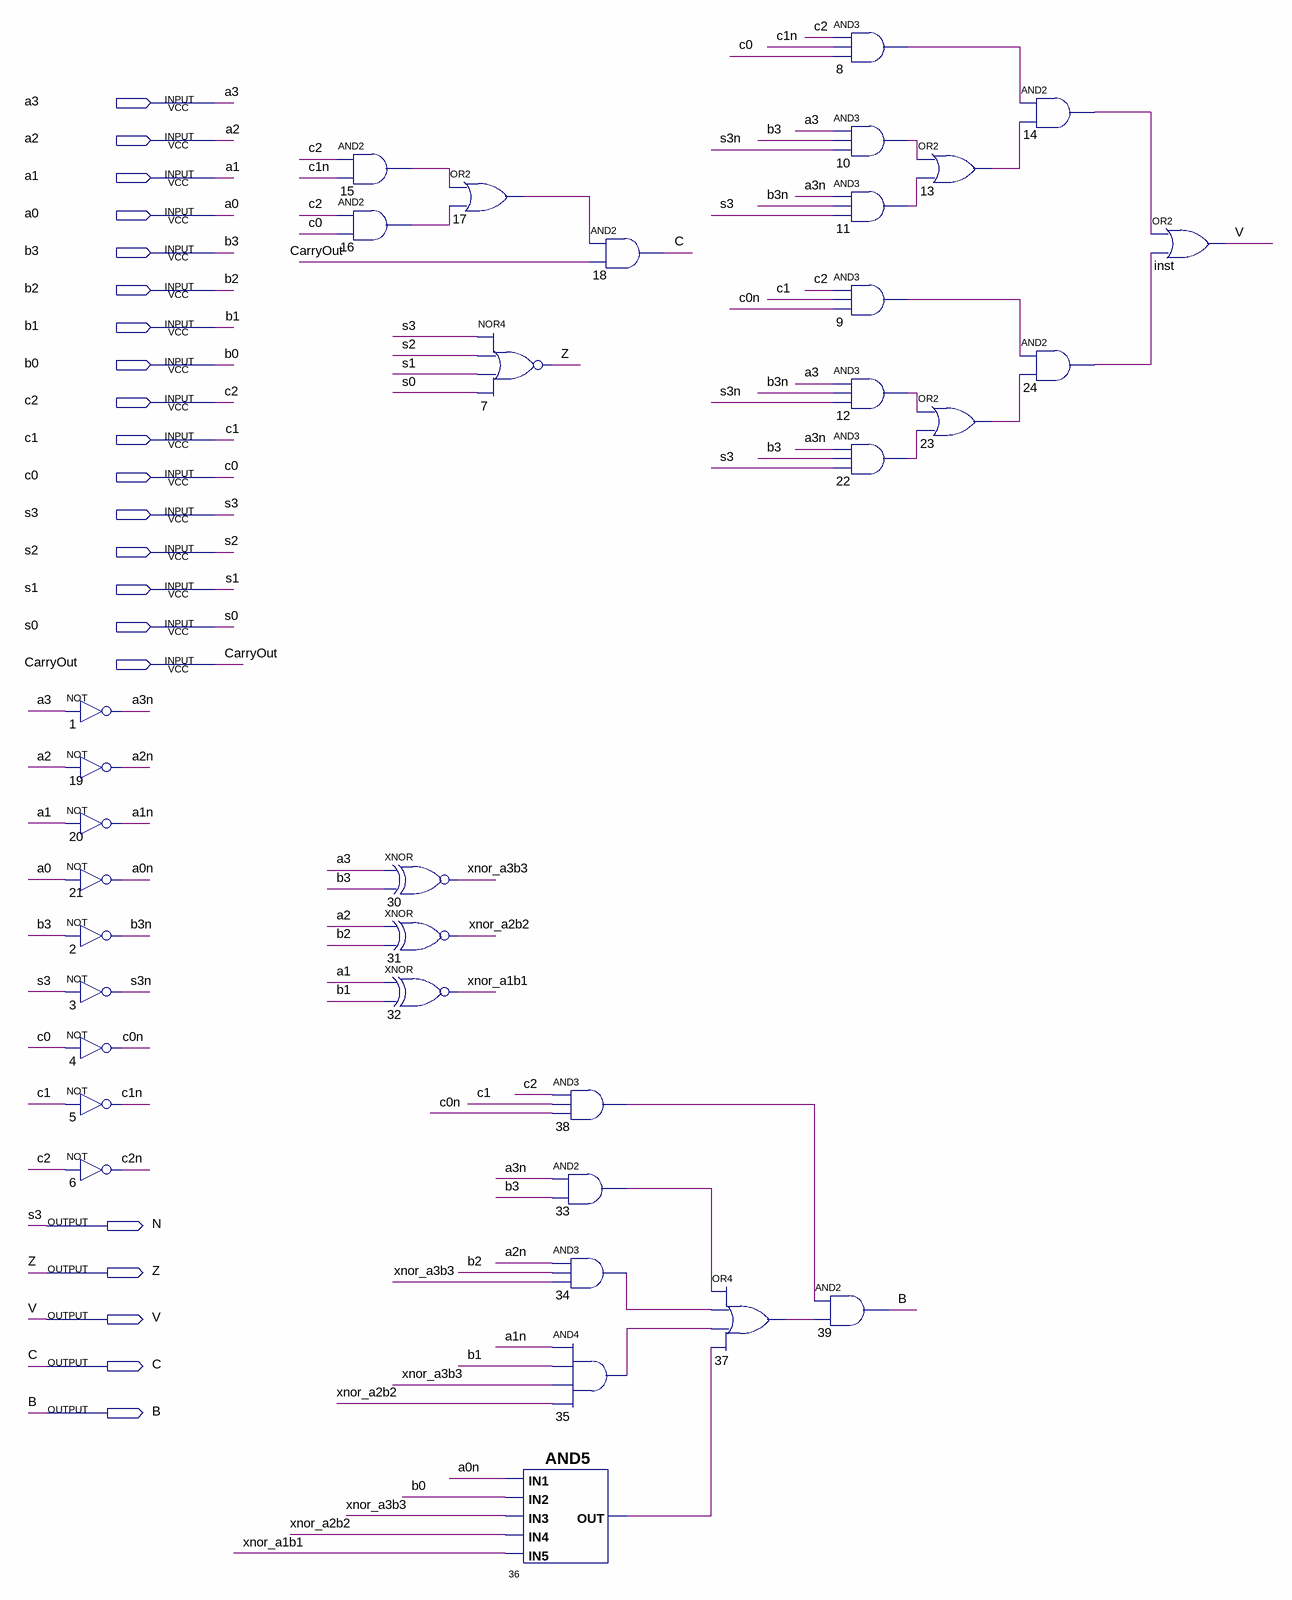
[diagram p0: schematic sheet]
// Quartus schematic flagsNZVCB.bdf as structural Verilog: 35 symbols, 21 pins
module flagsNZVCB (
  input  a3,
  input  a2,
  input  a1,
  input  a0,
  input  b3,
  input  b2,
  input  b1,
  input  b0,
  input  c2,
  input  c1,
  input  c0,
  input  s3,
  input  s2,
  input  s1,
  input  s0,
  input  CarryOut,
  output N,
  output Z,
  output V,
  output C,
  output B
);

  wire a0n, a1n, a2n, a3n, b3n, c0n, c1n, c2n, n8_out, n9_out, n10_out, n11_out, n12_out, n13_out, n14_out,
       n15_out, n16_out, n17_out, n22_out, n23_out, n24_out, n33_out, n34_out, n35_out, n36_out, n37_out,
       n38_out, s3n, xnor_a1b1, xnor_a2b2, xnor_a3b3;

  not u_1 (a3n, a3);
  not u_19 (a2n, a2);
  not u_20 (a1n, a1);
  not u_21 (a0n, a0);
  not u_2 (b3n, b3);
  not u_3 (s3n, s3);
  not u_4 (c0n, c0);
  not u_5 (c1n, c1);
  not u_6 (c2n, c2);
  and u_15 (n15_out, c2, c1n);
  and u_16 (n16_out, c2, c0);
  xnor u_30 (xnor_a3b3, a3, b3);
  xnor u_31 (xnor_a2b2, a2, b2);
  xnor u_32 (xnor_a1b1, a1, b1);
  or u_17 (n17_out, n15_out, n16_out);
  nor u_7 (Z, s3, s2, s1, s0);
  and u_38 (n38_out, c2, c1, c0n);
  and u_33 (n33_out, a3n, b3);
  and u_34 (n34_out, a2n, b2, xnor_a3b3);
  and u_35 (n35_out, a1n, b1, xnor_a3b3, xnor_a2b2);
  and u_36 (n36_out, a0n, b0, xnor_a3b3, xnor_a2b2, xnor_a1b1);
  and u_18 (C, n17_out, CarryOut);
  or u_37 (n37_out, n33_out, n34_out, n35_out, n36_out);
  and u_8 (n8_out, c2, c1n, c0);
  and u_10 (n10_out, a3, b3, s3n);
  and u_11 (n11_out, a3n, b3n, s3);
  and u_9 (n9_out, c2, c1, c0n);
  and u_12 (n12_out, a3, b3n, s3n);
  and u_22 (n22_out, a3n, b3, s3);
  and u_39 (B, n38_out, n37_out);
  or u_13 (n13_out, n10_out, n11_out);
  or u_23 (n23_out, n12_out, n22_out);
  and u_14 (n14_out, n8_out, n13_out);
  and u_24 (n24_out, n9_out, n23_out);
  or inst (V, n14_out, n24_out);

  assign N = s3;
endmodule
